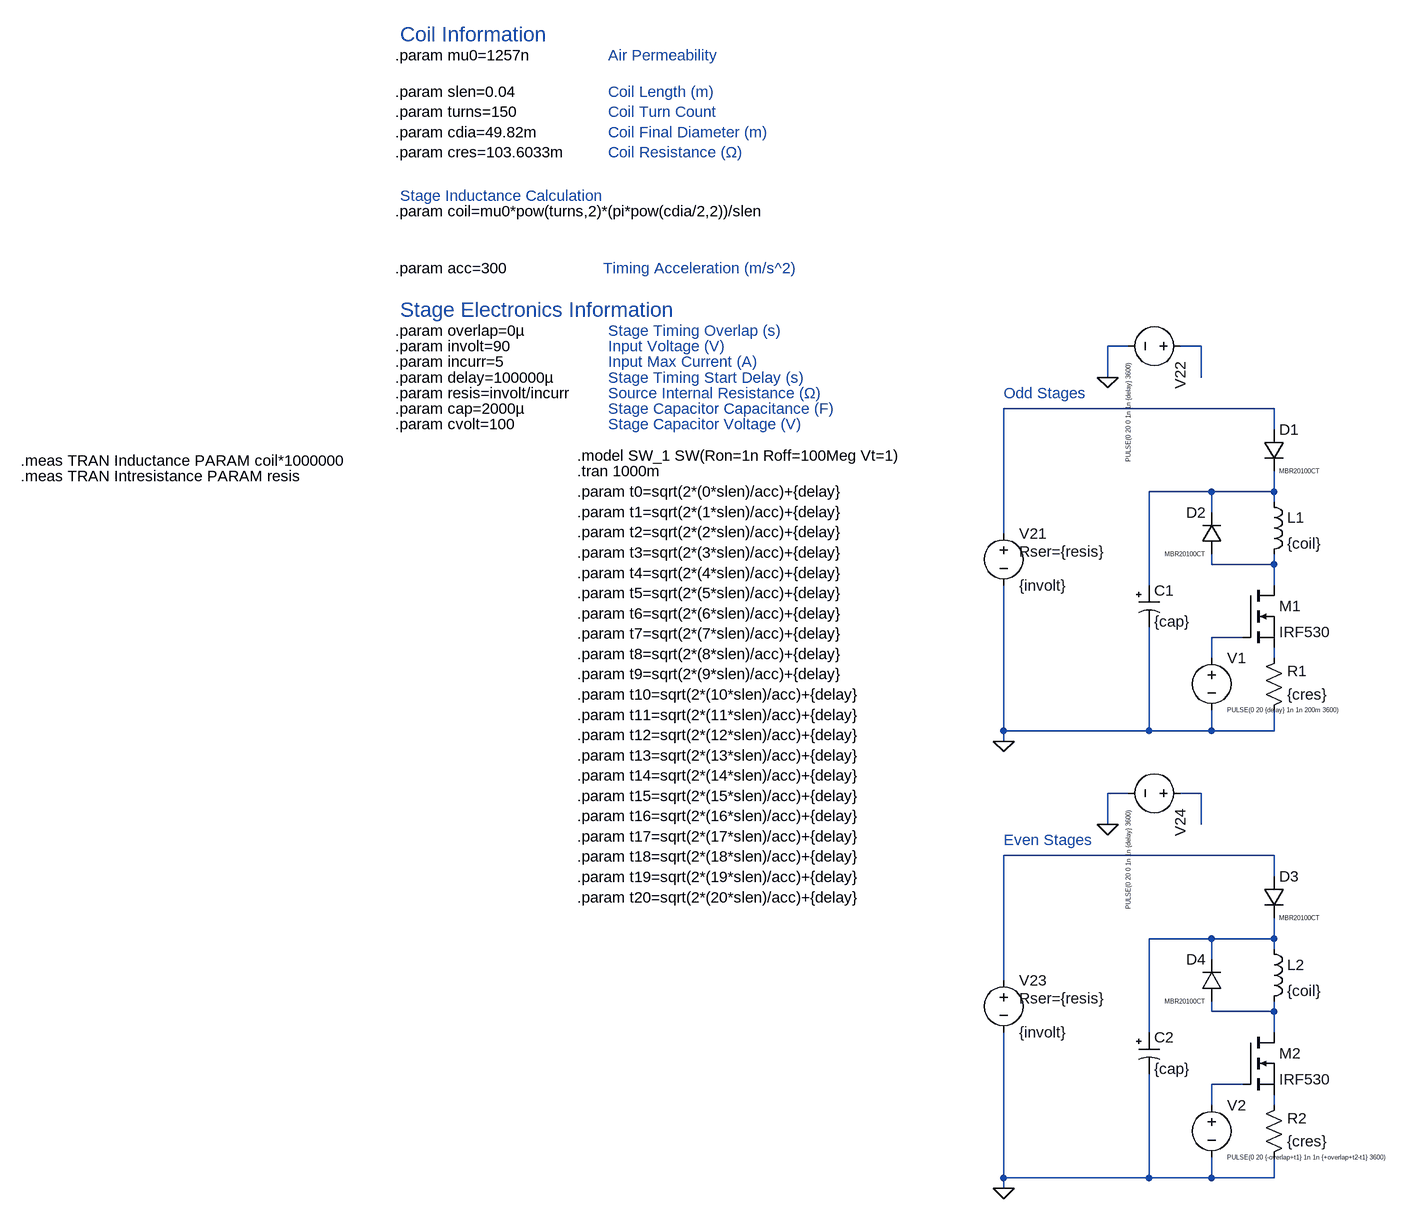
[diagram p0: schematic coilgun5.asc]
coilgun5.asc, the LTspice schematic file:
Version 4.1
SHEET 1 8016 1416
WIRE -96 -256 -128 -256
WIRE 16 -256 -16 -256
WIRE -128 -208 -128 -256
WIRE 16 -208 16 -256
WIRE 128 -160 -288 -160
WIRE 128 -128 128 -160
WIRE 32 -32 -64 -32
WIRE 128 -32 128 -64
WIRE 128 -32 32 -32
WIRE 128 -16 128 -32
WIRE 32 0 32 -32
WIRE -288 32 -288 -160
WIRE 32 80 32 64
WIRE 128 80 128 64
WIRE 128 80 32 80
WIRE -64 112 -64 -32
WIRE 128 112 128 80
WIRE 80 192 32 192
WIRE 32 224 32 192
WIRE 128 224 128 208
WIRE -288 336 -288 112
WIRE -64 336 -64 176
WIRE -64 336 -288 336
WIRE 32 336 32 304
WIRE 32 336 -64 336
WIRE 128 336 128 304
WIRE 128 336 32 336
WIRE -288 352 -288 336
WIRE -96 432 -128 432
WIRE 16 432 -16 432
WIRE -128 480 -128 432
WIRE 16 480 16 432
WIRE 128 528 -288 528
WIRE 128 560 128 528
WIRE 32 656 -64 656
WIRE 128 656 128 624
WIRE 128 656 32 656
WIRE 128 672 128 656
WIRE 32 688 32 656
WIRE -288 720 -288 528
WIRE 32 768 32 752
WIRE 128 768 128 752
WIRE 128 768 32 768
WIRE -64 800 -64 656
WIRE 128 800 128 768
WIRE 80 880 32 880
WIRE 32 912 32 880
WIRE 128 912 128 896
WIRE -288 1024 -288 800
WIRE -64 1024 -64 864
WIRE -64 1024 -288 1024
WIRE 32 1024 32 992
WIRE 32 1024 -64 1024
WIRE 128 1024 128 992
WIRE 128 1024 32 1024
WIRE -288 1040 -288 1024
FLAG -288 352 0
FLAG -128 -208 0
FLAG -288 1040 0
FLAG -128 480 0
SYMBOL voltage -288 16 R0
WINDOW 123 0 0 Left 0
WINDOW 39 24 44 Left 2
SYMATTR SpiceLine Rser={resis}
SYMATTR InstName V21
SYMATTR Value {involt}
SYMBOL diode 112 -128 R0
WINDOW 3 24 64 Left 0
SYMATTR Value MBR20100CT
SYMATTR InstName D1
SYMBOL ind 112 -32 R0
SYMATTR InstName L1
SYMATTR Value {coil}
SYMBOL diode 48 64 R180
WINDOW 0 24 64 Left 2
WINDOW 3 24 0 Left 0
SYMATTR InstName D2
SYMATTR Value MBR20100CT
SYMBOL nmos 80 112 R0
SYMATTR InstName M1
SYMATTR Value IRF530
SYMBOL voltage 32 208 R0
WINDOW 3 24 96 Left 0
WINDOW 123 0 0 Left 0
WINDOW 39 0 0 Left 0
SYMATTR Value PULSE(0 20 {delay} 1n 1n 200m 3600)
SYMATTR InstName V1
SYMBOL polcap -80 112 R0
SYMATTR InstName C1
SYMATTR Value {cap}
SYMATTR SpiceLine V={cvolt}
SYMBOL voltage 0 -256 R90
WINDOW 3 24 96 Left 0
WINDOW 123 0 0 Left 0
WINDOW 39 0 0 Left 0
SYMATTR Value PULSE(0 20 0 1n 1n {delay} 3600)
SYMATTR InstName V22
SYMBOL voltage -288 704 R0
WINDOW 123 0 0 Left 0
WINDOW 39 24 44 Left 2
SYMATTR SpiceLine Rser={resis}
SYMATTR InstName V23
SYMATTR Value {involt}
SYMBOL diode 112 560 R0
WINDOW 3 24 64 Left 0
SYMATTR Value MBR20100CT
SYMATTR InstName D3
SYMBOL ind 112 656 R0
SYMATTR InstName L2
SYMATTR Value {coil}
SYMBOL diode 48 752 R180
WINDOW 0 24 64 Left 2
WINDOW 3 24 0 Left 0
SYMATTR InstName D4
SYMATTR Value MBR20100CT
SYMBOL nmos 80 800 R0
SYMATTR InstName M2
SYMATTR Value IRF530
SYMBOL voltage 32 896 R0
WINDOW 3 24 96 Left 0
WINDOW 123 0 0 Left 0
WINDOW 39 0 0 Left 0
SYMATTR Value PULSE(0 20 {-overlap+t1} 1n 1n {+overlap+t2-t1} 3600)
SYMATTR InstName V2
SYMBOL polcap -80 800 R0
SYMATTR InstName C2
SYMATTR Value {cap}
SYMATTR SpiceLine V={cvolt}
SYMBOL voltage 0 432 R90
WINDOW 3 24 96 Left 0
WINDOW 123 0 0 Left 0
WINDOW 39 0 0 Left 0
SYMATTR Value PULSE(0 20 0 1n 1n {delay} 3600)
SYMATTR InstName V24
SYMBOL res 112 320 M180
WINDOW 0 36 76 Left 2
WINDOW 3 36 40 Left 2
SYMATTR InstName R1
SYMATTR Value {cres}
SYMBOL res 112 1008 M180
WINDOW 0 36 76 Left 2
WINDOW 3 36 40 Left 2
SYMATTR InstName R2
SYMATTR Value {cres}
TEXT -944 -64 Left 2 !.tran 1000m
TEXT -944 -88 Left 2 !.model SW_1 SW(Ron=1n Roff=100Meg Vt=1)
TEXT -288 -184 Left 2 ;Odd Stages
TEXT -1224 -464 Left 2 !.param coil=mu0*pow(turns,2)*(pi*pow(cdia/2,2))/slen
TEXT -944 -32 Left 2 !.param t0=sqrt(2*(0*slen)/acc)+{delay}\n.param t1=sqrt(2*(1*slen)/acc)+{delay}\n.param t2=sqrt(2*(2*slen)/acc)+{delay}\n.param t3=sqrt(2*(3*slen)/acc)+{delay}\n.param t4=sqrt(2*(4*slen)/acc)+{delay}\n.param t5=sqrt(2*(5*slen)/acc)+{delay}\n.param t6=sqrt(2*(6*slen)/acc)+{delay}\n.param t7=sqrt(2*(7*slen)/acc)+{delay}\n.param t8=sqrt(2*(8*slen)/acc)+{delay}\n.param t9=sqrt(2*(9*slen)/acc)+{delay}\n.param t10=sqrt(2*(10*slen)/acc)+{delay}\n.param t11=sqrt(2*(11*slen)/acc)+{delay}\n.param t12=sqrt(2*(12*slen)/acc)+{delay}\n.param t13=sqrt(2*(13*slen)/acc)+{delay}\n.param t14=sqrt(2*(14*slen)/acc)+{delay}\n.param t15=sqrt(2*(15*slen)/acc)+{delay}\n.param t16=sqrt(2*(16*slen)/acc)+{delay}\n.param t17=sqrt(2*(17*slen)/acc)+{delay}\n.param t18=sqrt(2*(18*slen)/acc)+{delay}\n.param t19=sqrt(2*(19*slen)/acc)+{delay}\n.param t20=sqrt(2*(20*slen)/acc)+{delay}
TEXT -1224 -376 Left 2 !.param acc=300
TEXT -1224 -280 Left 2 !.param overlap=0µ
TEXT -1224 -256 Left 2 !.param involt=90
TEXT -1224 -704 Left 2 !.param mu0=1257n
TEXT -1800 -80 Left 2 !.meas TRAN Inductance PARAM coil*1000000
TEXT -1224 -208 Left 2 !.param delay=100000µ
TEXT -1224 -184 Left 2 !.param resis=involt/incurr
TEXT -1224 -160 Left 2 !.param cap=2000µ
TEXT -896 -280 Left 2 ;Stage Timing Overlap (s)
TEXT -896 -256 Left 2 ;Input Voltage (V)
TEXT -896 -208 Left 2 ;Stage Timing Start Delay (s)
TEXT -896 -184 Left 2 ;Source Internal Resistance (Ω)
TEXT -896 -160 Left 2 ;Stage Capacitor Capacitance (F)
TEXT -896 -704 Left 2 ;Air Permeability
TEXT -1216 -312 Left 3 ;Stage Electronics Information
TEXT -904 -376 Left 2 ;Timing Acceleration (m/s^2)
TEXT -1216 -488 Left 2 ;Stage Inductance Calculation
TEXT -288 504 Left 2 ;Even Stages
TEXT -1224 -136 Left 2 !.param cvolt=100
TEXT -896 -136 Left 2 ;Stage Capacitor Voltage (V)
TEXT -1224 -232 Left 2 !.param incurr=5
TEXT -896 -232 Left 2 ;Input Max Current (A)
TEXT -1800 -56 Left 2 !.meas TRAN Intresistance PARAM resis
TEXT -1216 -736 Left 3 ;Coil Information
TEXT -1224 -648 Left 2 !.param slen=0.04\n.param turns=150\n.param cdia=49.82m\n.param cres=103.6033m
TEXT -896 -648 Left 2 ;Coil Length (m)\nCoil Turn Count\nCoil Final Diameter (m)\nCoil Resistance (Ω)

The netlist it stands for:
* coilgun5.asc
V21 N002 0 {involt} Rser={resis}
D1 N002 N003 MBR20100CT
L1 N003 N004 {coil}
D2 N004 N003 MBR20100CT
M1 N004 N005 N006 N006 IRF530
V1 N005 0 PULSE(0 20 {delay} 1n 1n 200m 3600)
C1 N003 0 {cap} V={cvolt}
V22 N001 0 PULSE(0 20 0 1n 1n {delay} 3600)
V23 N008 0 {involt} Rser={resis}
D3 N008 N009 MBR20100CT
L2 N009 N010 {coil}
D4 N010 N009 MBR20100CT
M2 N010 N011 N012 N012 IRF530
V2 N011 0 PULSE(0 20 {-overlap+t1} 1n 1n {+overlap+t2-t1} 3600)
C2 N009 0 {cap} V={cvolt}
V24 N007 0 PULSE(0 20 0 1n 1n {delay} 3600)
R1 0 N006 {cres}
R2 0 N012 {cres}
.model D D
.lib standard.dio
.model NMOS NMOS
.model PMOS PMOS
.lib standard.mos
.tran 1000m
.model SW_1 SW(Ron=1n Roff=100Meg Vt=1)
* Odd Stages
.param coil=mu0*pow(turns,2)*(pi*pow(cdia/2,2))/slen
.param t0=sqrt(2*(0*slen)/acc)+{delay}
.param t1=sqrt(2*(1*slen)/acc)+{delay}
.param t2=sqrt(2*(2*slen)/acc)+{delay}
.param t3=sqrt(2*(3*slen)/acc)+{delay}
.param t4=sqrt(2*(4*slen)/acc)+{delay}
.param t5=sqrt(2*(5*slen)/acc)+{delay}
.param t6=sqrt(2*(6*slen)/acc)+{delay}
.param t7=sqrt(2*(7*slen)/acc)+{delay}
.param t8=sqrt(2*(8*slen)/acc)+{delay}
.param t9=sqrt(2*(9*slen)/acc)+{delay}
.param t10=sqrt(2*(10*slen)/acc)+{delay}
.param t11=sqrt(2*(11*slen)/acc)+{delay}
.param t12=sqrt(2*(12*slen)/acc)+{delay}
.param t13=sqrt(2*(13*slen)/acc)+{delay}
.param t14=sqrt(2*(14*slen)/acc)+{delay}
.param t15=sqrt(2*(15*slen)/acc)+{delay}
.param t16=sqrt(2*(16*slen)/acc)+{delay}
.param t17=sqrt(2*(17*slen)/acc)+{delay}
.param t18=sqrt(2*(18*slen)/acc)+{delay}
.param t19=sqrt(2*(19*slen)/acc)+{delay}
.param t20=sqrt(2*(20*slen)/acc)+{delay}
.param acc=300
.param overlap=0µ
.param involt=90
.param mu0=1257n
.meas TRAN Inductance PARAM coil*1000000
.param delay=100000µ
.param resis=involt/incurr
.param cap=2000µ
* Stage Timing Overlap (s)
* Input Voltage (V)
* Stage Timing Start Delay (s)
* Source Internal Resistance (Ω)
* Stage Capacitor Capacitance (F)
* Air Permeability
* Stage Electronics Information
* Timing Acceleration (m/s^2)
* Stage Inductance Calculation
* Even Stages
.param cvolt=100
* Stage Capacitor Voltage (V)
.param incurr=5
* Input Max Current (A)
.meas TRAN Intresistance PARAM resis
* Coil Information
.param slen=0.04
.param turns=150
.param cdia=49.82m
.param cres=103.6033m
* Coil Length (m)
* Coil Turn Count
* Coil Final Diameter (m)
* Coil Resistance (Ω)
.backanno
.end